# Altium project CyberDriveControllerBoard.PrjPcb
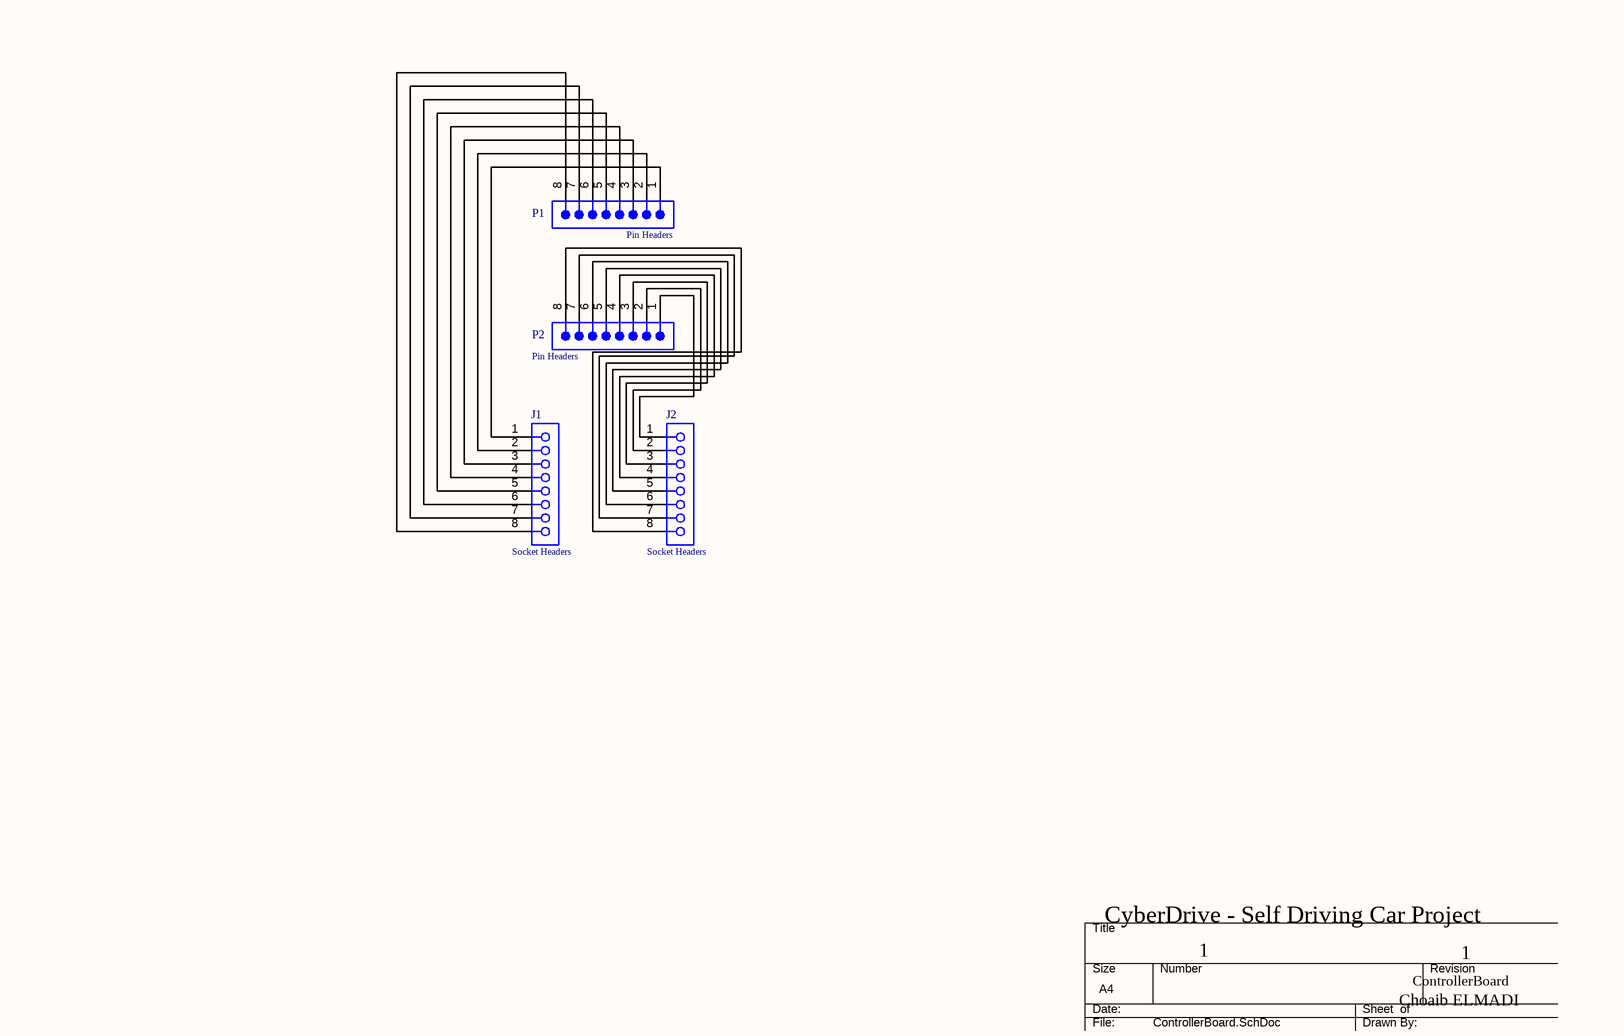
[diagram p0: ControllerBoard.SchDoc]
1 sheet, 4 parts. Net scope: global (net labels, ports and power ports of the same name join across sheets).
Board file: ControllerBoard.PcbDoc

## Sheet ControllerBoard.SchDoc: CyberDrive - Python Self Driving Car Project
size A4; ApprovedBy: Choaib ELMADI; CheckedBy: Choaib ELMADI; Author: Choaib ELMADI; CompanyName: ENSA Marrakech - SEECS Student; DrawnBy: Choaib ELMADI; Revision: 1; SheetNumber: 1; SheetTotal: 1; ENG_APP_DATE: --/--/--; DSN_APP_DATE: --/--/--; CHK_APP_DATE: --/--/--

### Parts
J1  Socket Headers  [61300811821]
J2  Socket Headers  [61300811821]
P1  Pin Headers  [61300811121]
P2  Pin Headers  [61300811121]

### Nets
NetJ1_1: J1.1 P1.1
NetJ1_2: J1.2 P1.2
NetJ1_3: J1.3 P1.3
NetJ1_4: J1.4 P1.4
NetJ1_5: J1.5 P1.5
NetJ1_6: J1.6 P1.6
NetJ1_7: J1.7 P1.7
NetJ1_8: J1.8 P1.8
NetJ2_1: J2.1 P2.1
NetJ2_2: J2.2 P2.2
NetJ2_3: J2.3 P2.3
NetJ2_4: J2.4 P2.4
NetJ2_5: J2.5 P2.5
NetJ2_6: J2.6 P2.6
NetJ2_7: J2.7 P2.7
NetJ2_8: J2.8 P2.8

### Notes on the sheet
- CyberDrive - Self Driving Car Project
- 1
- ControllerBoard
- Choaib ELMADI
- DWG. NO.
- REV.
- SHT.
- THIS DOCUMENT AND THE DATA DISCLOSED HEREIN OR HEREWITH IS THE PROPERTY OF ALTIUM LIMITED AND MAY BE FREELY DISTRIBUTED IN WHOLE. NO RIGHTS ARE RESERVED OR EXPRESS OR IMPLIED WARANTEE GIVEN.
- REVISION
- DESCRIPTION
- DATE
- APPROVED
- ENG:
- APPROVALS
- PROJECT
- DSN:
- CHK:
- REFERENCE DOCUMENTS
- PROJECT REVISION:
- TITLE
- DOCUMENT REVISION:
- DESIGN ITEM:
- BOM:
- FAB DWG:
- PCB DWG:
- ASSY DWG:
- SCALE:
- SIZE
- B
- CAGE CODE
- FILE NAME
- DWG NO.
- SHEET
- OF
- REV

### Library data of the parts
J1 J2 = CMP-1502-01327-2: NexarPartId: 61924723; Contact Resistance: 20mΩ; Current Rating: 3A; Operating Supply Voltage: 250V; Gender: Female; Number of Pins: 8; Orientation: Vertical; Lead Pitch: 2.54mm; RoHS: Non-Compliant
P1 P2 = CMP-1502-01076-2: NexarPartId: 32855533; Current Rating: 3A; Connector Type: Male Pin; Voltage Rating: 250V; Number of Contacts: 8; Pitch: 2.54mm; Contact Resistance: 20mΩ; Gender: Male; REACH SVHC: Unknown; Number of Rows: 1; Mount: Through Hole; Termination: Solder; Number of Pins: 8; Number of Positions: 8; Height: 8.54mm; Contact Mating Length: 5.9944mm; Orientation: Vertical; Operating Supply Voltage: 250V; Min Operating Temperature: -40°C; Max Operating Temperature: 105°C; Packaging: Bulk; Color: Black; Lead Pitch: 2.54mm; RoHS: Compliant; Contact Material: Copper; Contact Plating: Gold